# Altium project Manipulator.PrjPcb
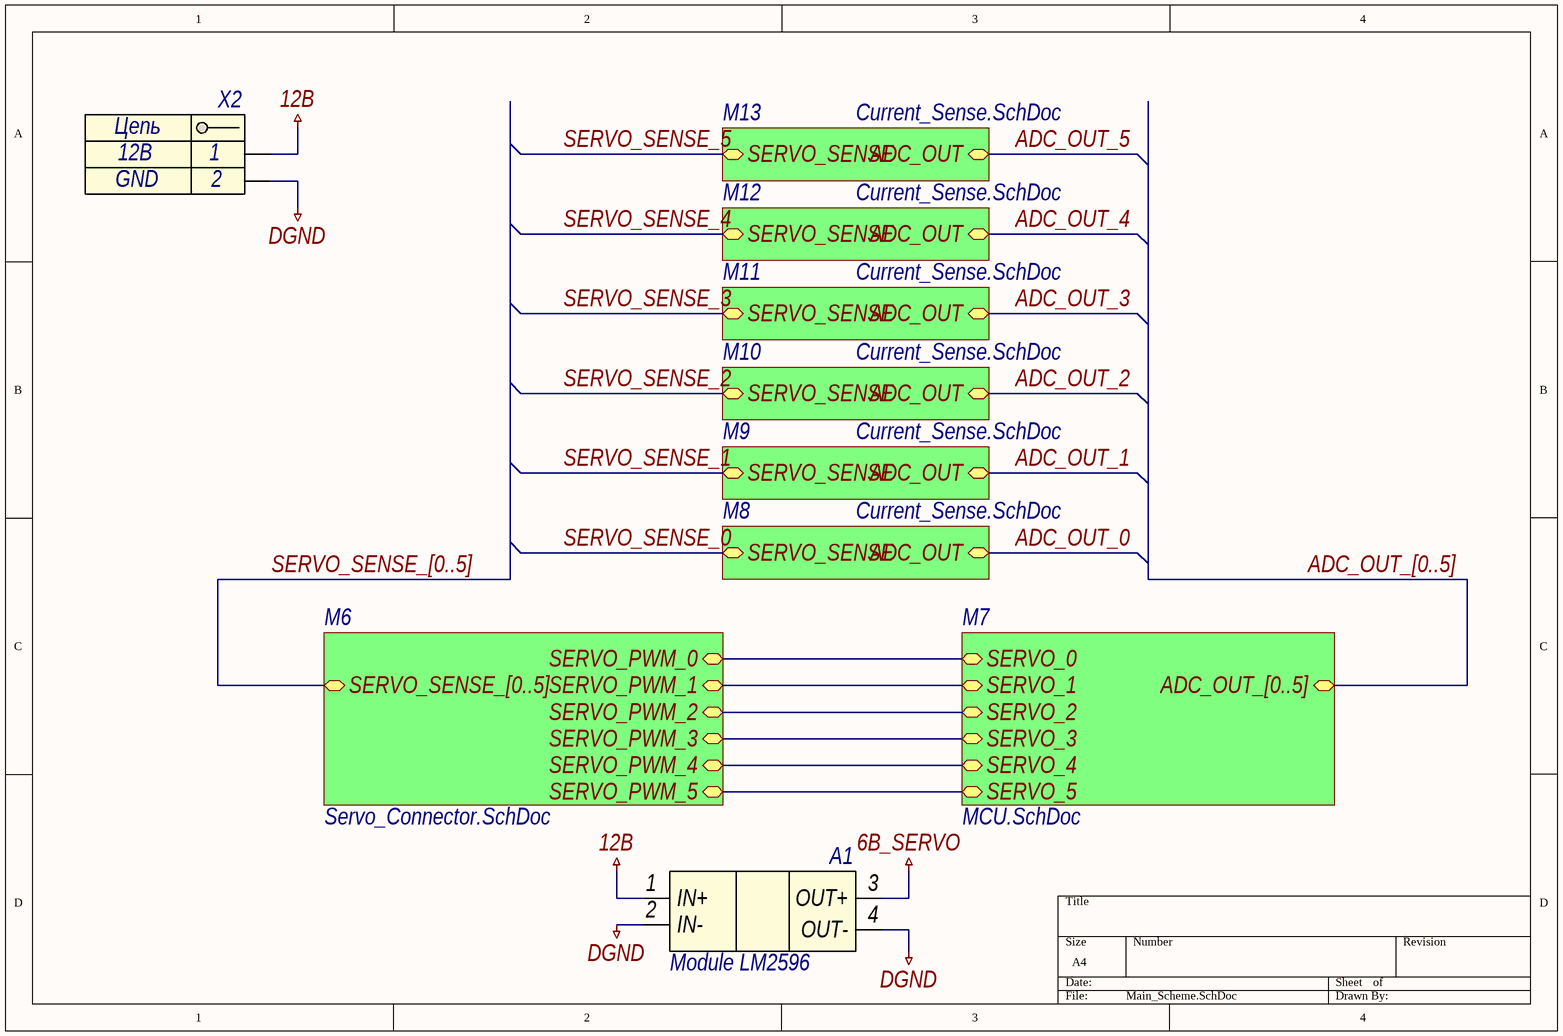
[diagram p0: Main_Scheme.SchDoc]
4 sheets, 55 parts. Net scope: hierarchical (ports join the sheet entries above them; power ports are global).
Board file: Manipulator.PcbDoc
Sheets:
  Main_Scheme.SchDoc
    M6 = Servo_Connector.SchDoc
    M7 = MCU.SchDoc
    M8 = Current_Sense.SchDoc
    M9 = Current_Sense.SchDoc
    M10 = Current_Sense.SchDoc
    M11 = Current_Sense.SchDoc
    M12 = Current_Sense.SchDoc
    M13 = Current_Sense.SchDoc

## Sheet Main_Scheme.SchDoc
size A4

### Parts
A1  Module LM2596  [module LM2596]
X2  Header_2_trm  [TERMINAL-2WAY-3.5MM]  (value not drawn)

### Sub-sheets
M6 = Servo_Connector.SchDoc: SERVO_PWM_3, SERVO_PWM_2, SERVO_PWM_4, SERVO_PWM_5, SERVO_PWM_0, SERVO_PWM_1, SERVO_SENSE_[0..5]
M7 = MCU.SchDoc: SERVO_0, SERVO_5, SERVO_4, SERVO_3, SERVO_2, SERVO_1, ADC_OUT_[0..5]
M8 = Current_Sense.SchDoc: ADC_OUT, SERVO_SENSE
M9 = Current_Sense.SchDoc: ADC_OUT, SERVO_SENSE
M10 = Current_Sense.SchDoc: ADC_OUT, SERVO_SENSE
M11 = Current_Sense.SchDoc: ADC_OUT, SERVO_SENSE
M12 = Current_Sense.SchDoc: ADC_OUT, SERVO_SENSE
M13 = Current_Sense.SchDoc: ADC_OUT, SERVO_SENSE

### Nets
6В_SERVO: A1.3(OUT+)
12В: A1.1(IN+) X2.1
DGND: A1.2(IN-) A1.4(OUT-) X2.2
NetDD1_1: sheet M6/SERVO_PWM_3, sheet M7/SERVO_3
NetDD1_2: sheet M6/SERVO_PWM_4, sheet M7/SERVO_4
NetDD1_9: sheet M6/SERVO_PWM_5, sheet M7/SERVO_5
NetDD1_30: sheet M6/SERVO_PWM_0, sheet M7/SERVO_0
NetDD1_31: sheet M6/SERVO_PWM_1, sheet M7/SERVO_1
NetDD1_32: sheet M6/SERVO_PWM_2, sheet M7/SERVO_2

### Buses and harness runs
bus ADC_OUT_[0..5] = sheet M7/ADC_OUT_[0..5]
bus SERVO_SENSE_[0..5] = sheet M6/SERVO_SENSE_[0..5]

### Notes on the sheet
- (in symbol connect34) Цепь

### Library data of the parts
A1 = module0: Low-Dropout Regulator for 5-V to 3.3-V Conversion; id: module0; Part Name: LM2596
X2 = connect34: Разъем - 2 конт. клеммник; Part Name: TERMINAL BLOCK 2 way; Contact_1: 12В; Contact_2: GND; Etch: 3.5mm; id: connect34

## Sheet Servo_Connector.SchDoc
size A4
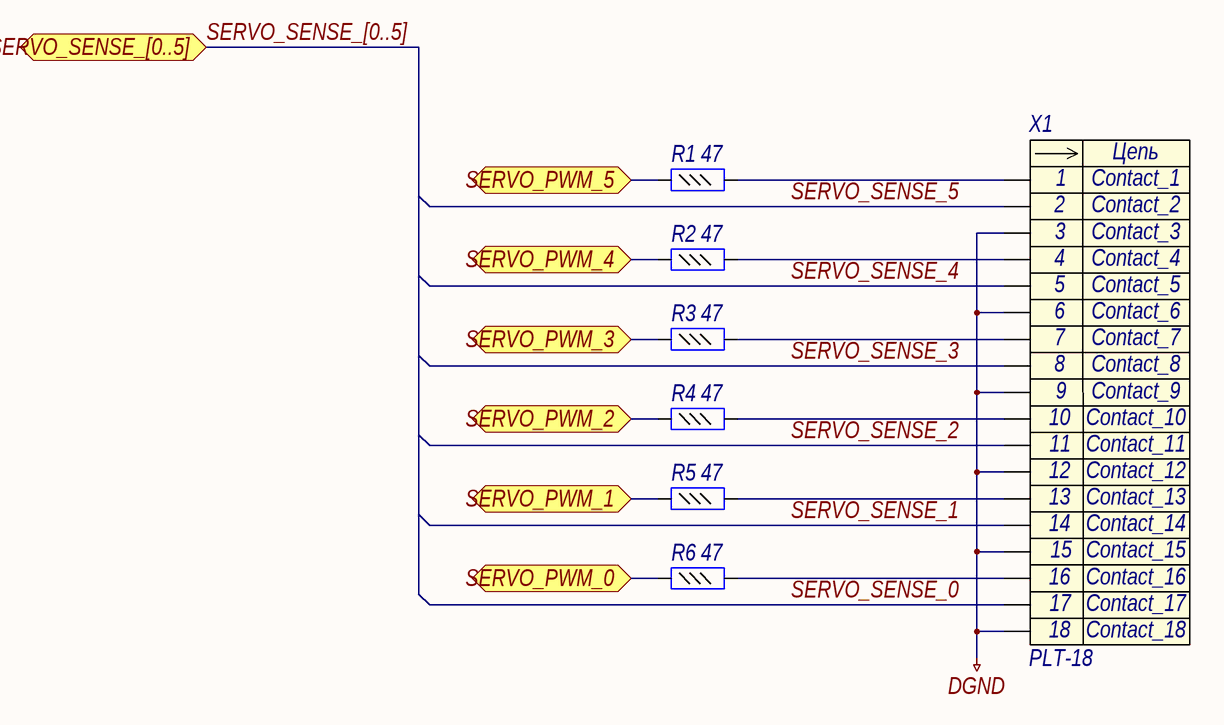
[diagram p1: Servo_Connector.SchDoc]

### Parts
R1  value 47  [R0603]  (hidden comment: Resistor_0,062Вт)
R2  value 47  [R0603]  (hidden comment: Resistor_0,062Вт)
R3  value 47  [R0603]  (hidden comment: Resistor_0,062Вт)
R4  value 47  [R0603]  (hidden comment: Resistor_0,062Вт)
R5  value 47  [R0603]  (hidden comment: Resistor_0,062Вт)
R6  value 47  [R0603]  (hidden comment: Resistor_0,062Вт)
X1  PLT-18  [PLT-18]

### Ports
SERVO_PWM_0, SERVO_PWM_1, SERVO_PWM_2, SERVO_PWM_3, SERVO_PWM_4, SERVO_PWM_5, SERVO_SENSE_[0..5]

### Nets
DGND: X1.3 X1.6 X1.9 X1.12 X1.15 X1.18
SERVO_SENSE_0: X1.17
SERVO_SENSE_1: X1.14
SERVO_SENSE_2: X1.11
SERVO_SENSE_3: X1.8
SERVO_SENSE_4: X1.5
SERVO_SENSE_5: X1.2
NetDD1_1: R3.1 ; port SERVO_PWM_3
NetDD1_2: R2.1 ; port SERVO_PWM_4
NetDD1_9: R1.1 ; port SERVO_PWM_5
NetDD1_30: R6.1 ; port SERVO_PWM_0
NetDD1_31: R5.1 ; port SERVO_PWM_1
NetDD1_32: R4.1 ; port SERVO_PWM_2
NetR1_2: R1.2 X1.1
NetR2_2: R2.2 X1.4
NetR3_2: R3.2 X1.7
NetR4_2: R4.2 X1.10
NetR5_2: R5.2 X1.13
NetR6_2: R6.2 X1.16

### Buses and harness runs
bus SERVO_SENSE_[0..5] = port SERVO_SENSE_[0..5]

### Notes on the sheet
- (in symbol connect129) Цепь

### Library data of the parts
R1-R6 = res431: Резистор; Manufacture: Yageo; Part Number: RC0603FR-0747RL; id: res431; Accuracy: 0,01; Part Name: Resistor; Power: 0,062Вт
X1 = connect129: Разъем - 18 конт. вилка; Part Number: PLT-81; Manufacture: Ningbo connfly electronic; Etch: 2.54mm; Part Name: PLT-18; Contact_1: Contact_1; Contact_2: Contact_2; Contact_3: Contact_3; Contact_4: Contact_4; Contact_5: Contact_5; Contact_6: Contact_6; id: connect129; Contact_7: Contact_7; Contact_8: Contact_8; Contact_9: Contact_9; Contact_10: Contact_10; Contact_11: Contact_11; Contact_12: Contact_12; Contact_13: Contact_13; Contact_14: Contact_14; Contact_15: Contact_15; Contact_16: Contact_16; Contact_17: Contact_17; Contact_18: Contact_18; Contact_19: Contact_19; Contact_20: Contact_20

## Sheet MCU.SchDoc
size A3
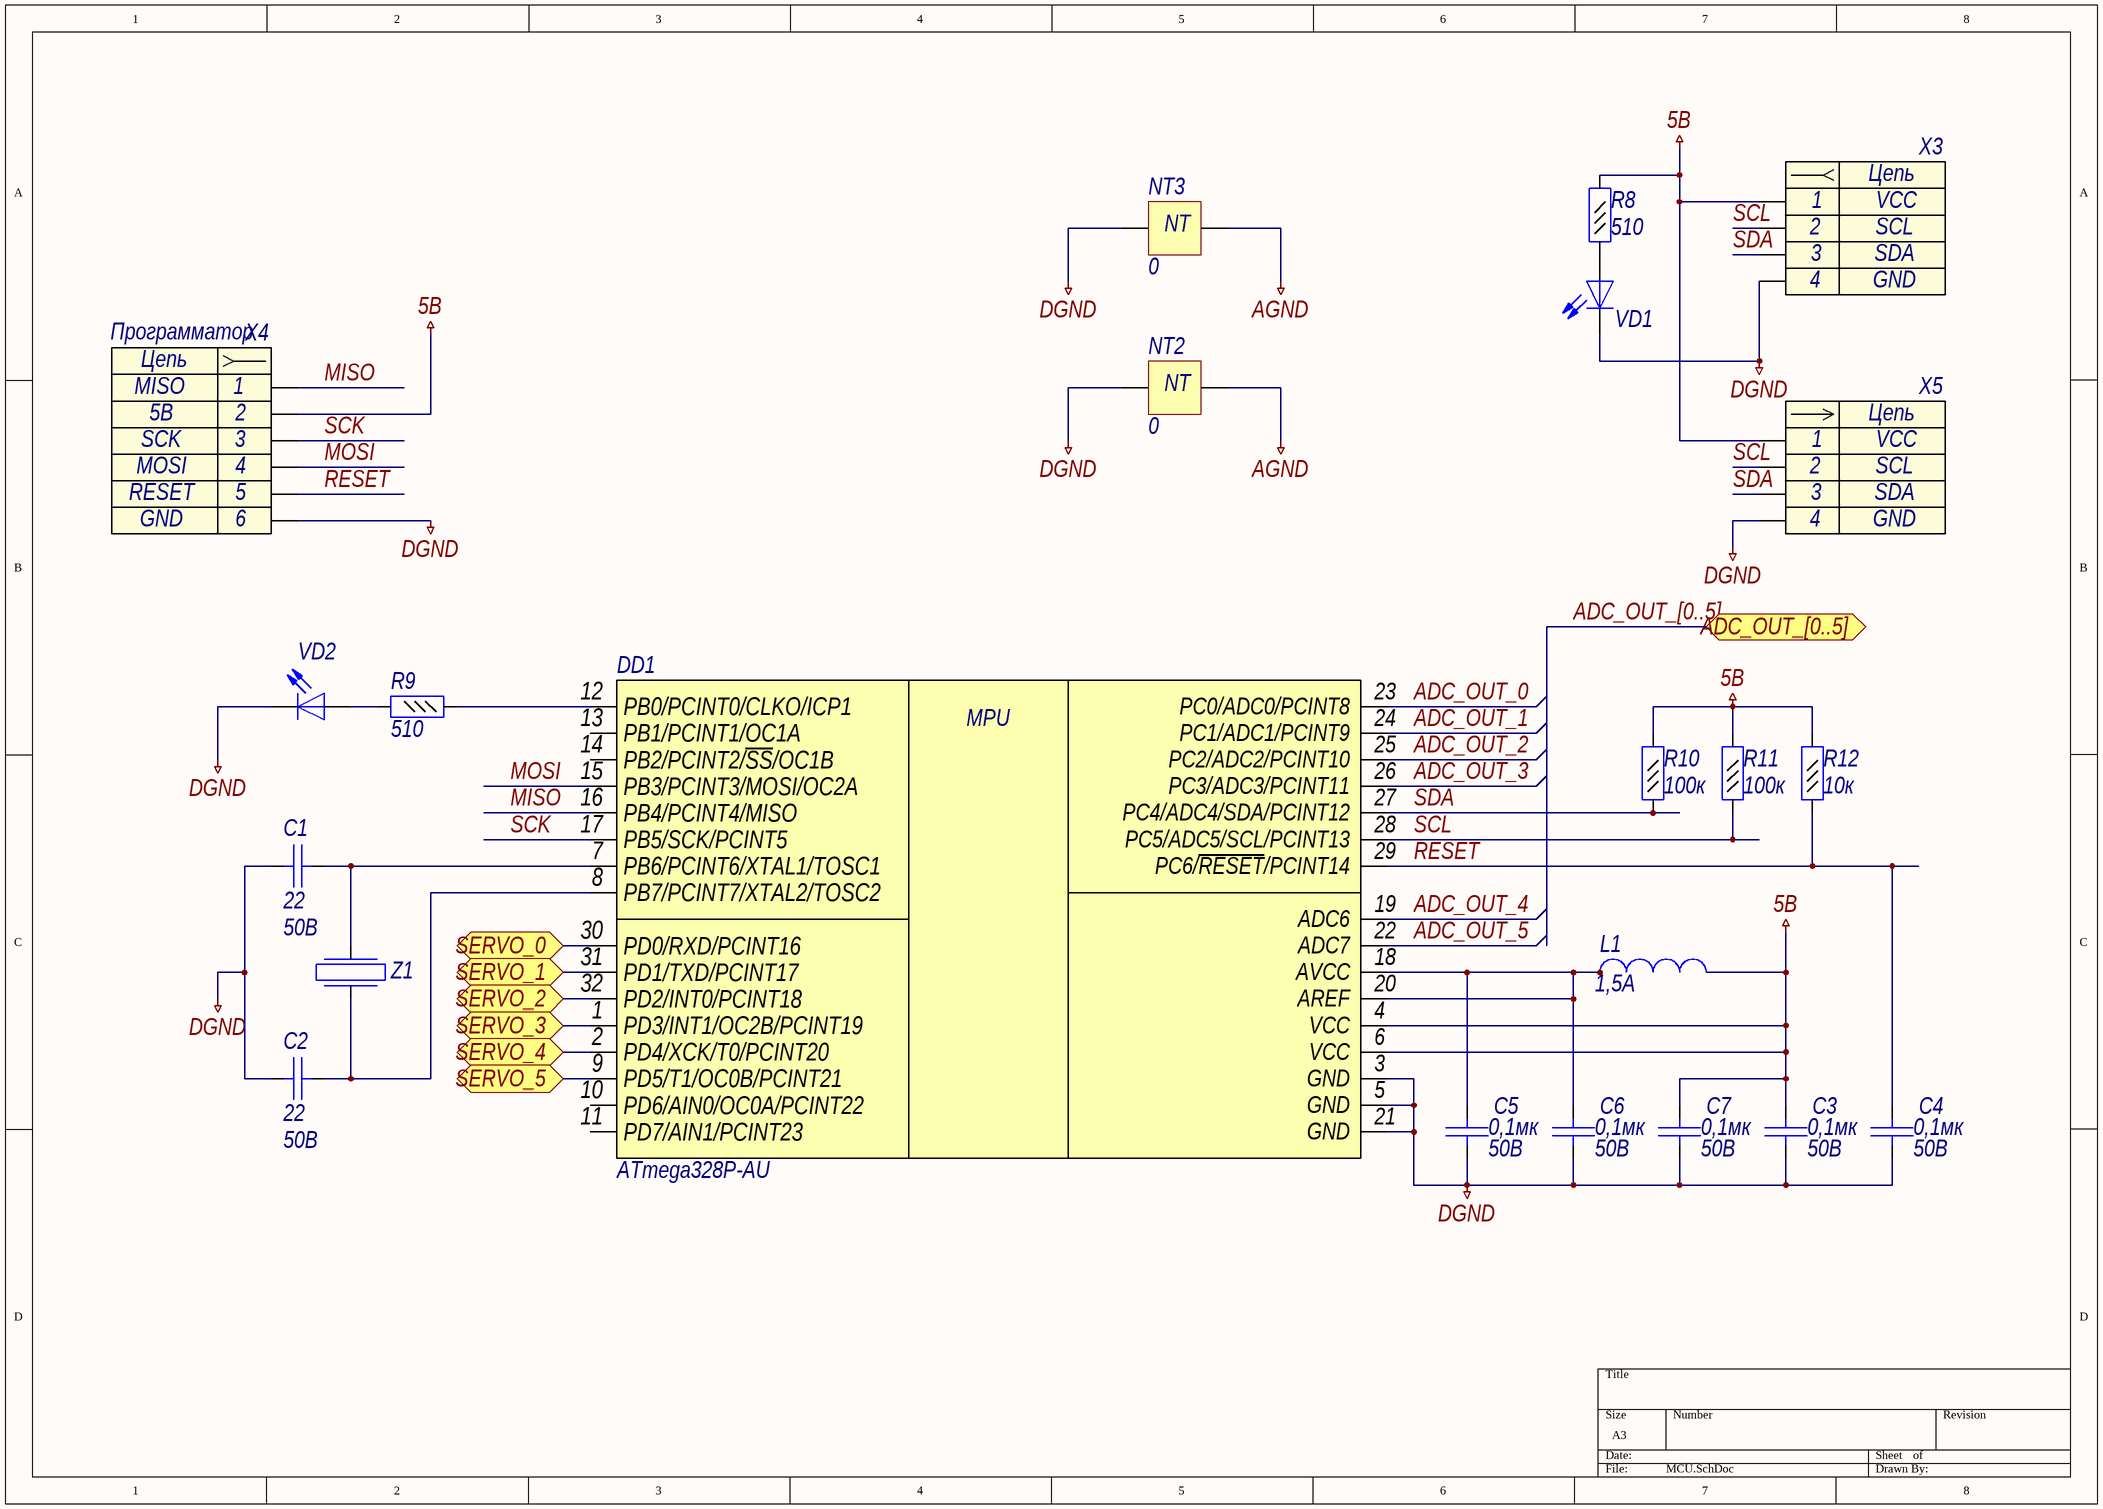
[diagram p2: MCU.SchDoc]

### Parts
C1  Voltage: 50B  [C0603]  (hidden comment: 22)
C2  Voltage: 50B  [C0603]  (hidden comment: 22)
C3  Voltage: 50B  [C0603]  (hidden comment: 0,1мк)
C4  Voltage: 50B  [C0603]  (hidden comment: 0,1мк)
C5  Voltage: 50B  [C0603]  (hidden comment: 0,1мк)
C6  Voltage: 50B  [C0603]  (hidden comment: 0,1мк)
C7  Voltage: 50B  [C0603]  (hidden comment: 0,1мк)
DD1  ATmega328P-AU  [TQFP-32]
L1  Rated Current: 1,5A  [L0603]  (hidden comment: Inductor)
NT2  value 0  [Pofigistor0603]  (hidden comment: Pofigistor)  (net tie, no BOM)
NT3  value 0  [Pofigistor0603]  (hidden comment: Pofigistor)  (net tie, no BOM)
R8  value 510  [R0603]  (hidden comment: Resistor_0,062Вт)
R9  value 510  [R0603]  (hidden comment: Resistor_0,062Вт)
R10  value 100к  [R0603]  (hidden comment: Resistor_0,062Вт)
R11  value 100к  [R0603]  (hidden comment: Resistor_0,062Вт)
R12  value 10к  [R0603]  (hidden comment: Resistor_0,062Вт)
VD1  LED  [L_0805]  (value not drawn)
VD2  LED  [L_0805]  (value not drawn)
X3  Header_4_sct  [RJ11_4P4C_V]  (value not drawn)
X4  Программатор  [PLS2-6]
X5  Header_4_plg  [PLS-4]  (value not drawn)
Z1  Crystal  [HC-49SM]  (value not drawn)

### Ports
ADC_OUT_[0..5], SERVO_0, SERVO_1, SERVO_2, SERVO_3, SERVO_4, SERVO_5

### Nets
5В: C3.2 C7.2 DD1.4(VCC) DD1.6(VCC) L1.2 R8.2 R10.2 R11.2 R12.2 X3.1 X4.2 X5.1
AGND: NT2.2 NT3.2
DGND: C1.1 C2.1 C3.1 C4.1 C5.1 C6.1 C7.1 DD1.3(GND) DD1.5(GND) DD1.21(GND) NT2.1 NT3.1 VD1.1(K) VD2.1(K) X3.4 X4.6 X5.4
ADC_OUT_0: DD1.23(PC0/ADC0/PCINT8)
ADC_OUT_1: DD1.24(PC1/ADC1/PCINT9)
ADC_OUT_2: DD1.25(PC2/ADC2/PCINT10)
ADC_OUT_3: DD1.26(PC3/ADC3/PCINT11)
ADC_OUT_4: DD1.19(ADC6)
ADC_OUT_5: DD1.22(ADC7)
MISO: DD1.16(PB4/PCINT4/MISO) X4.1
MOSI: DD1.15(PB3/PCINT3/MOSI/OC2A) X4.4
RESET: C4.2 DD1.29(PC6/~{RESET}/PCINT14) R12.1 X4.5
SCK: DD1.17(PB5/SCK/PCINT5) X4.3
SCL: DD1.28(PC5/ADC5/SCL/PCINT13) R11.1 X3.2 X5.2
SDA: DD1.27(PC4/ADC4/SDA/PCINT12) R10.1 X3.3 X5.3
NetC1_2: C1.2 DD1.7(PB6/PCINT6/XTAL1/TOSC1) Z1.2
NetC2_2: C2.2 DD1.8(PB7/PCINT7/XTAL2/TOSC2) Z1.1
NetC5_2: C5.2 C6.2 DD1.18(AVCC) DD1.20(AREF) L1.1
NetDD1_1: DD1.1(PD3/INT1/OC2B/PCINT19) ; port SERVO_3
NetDD1_2: DD1.2(PD4/XCK/T0/PCINT20) ; port SERVO_4
NetDD1_9: DD1.9(PD5/T1/OC0B/PCINT21) ; port SERVO_5
NetDD1_12: DD1.12(PB0/PCINT0/CLKO/ICP1) R9.1
NetDD1_30: DD1.30(PD0/RXD/PCINT16) ; port SERVO_0
NetDD1_31: DD1.31(PD1/TXD/PCINT17) ; port SERVO_1
NetDD1_32: DD1.32(PD2/INT0/PCINT18) ; port SERVO_2
NetR8_1: R8.1 VD1.2(A)
NetR9_2: R9.2 VD2.2(A)

Not connected (* = marked no-connect by the designer): DD1 10(PD6/AIN0/OC0A/PCINT22) 11(PD7/AIN1/PCINT23) 13(PB1/PCINT1/OC1A) 14(PB2/PCINT2/~{SS}/OC1B)

### Buses and harness runs
bus ADC_OUT_[0..5] = port ADC_OUT_[0..5]

### Notes on the sheet
- (in symbol connect0) Цепь
- (in symbol connect14) Цепь
- (in symbol connect73) Цепь
- (in symbol microcont1) MPU
- (in symbol res970) NT

### Library data of the parts
C1 C2 = cap77: Конденсатор; Part Name: Ceramic; Manufacture: Yageo; Part Number: CC0603JRNPO9BN220; id: cap77; TKE: NP0; Value: 22
C3-C7 = cap131: Конденсатор; Part Name: Ceramic; Manufacture: Murata; Part Number: GRM188R71H104KA93D; id: cap131; TKE: X7R; Value: 0,1мк
DD1 = microcont1: Микроконтроллер 8-Бит, picoPower, AVR, 20МГц, 32КБ Flash; Part Name: Microcontroller; Frequency: 20MHz; ADC: 8x10b; Interface: i2c, spi, uart; Flash: 32kb; Pin in: 23; Power Supply: 1.8-5.5 V; id: microcont1; Part Number: ATmega328P-AU
L1 = ind0: EMI Suppression Filter; Part Name: EMI Suppression Filters; Part Number: BLM18PG181SN1D; id: ind0; Resistance: 0,09Ohm
NT2 NT3 = res970: Part Name: NET TIE; id: res970
R8 R9 = res456: Резистор; Manufacture: Yageo; Part Number: RC0603FR-07510RL; id: res456; Accuracy: 0,01; Part Name: Resistor; Power: 0,062Вт
R10 R11 = res511: Резистор; Manufacture: Yageo; Part Number: RC0603FR-07100KL; id: res511; Accuracy: 0,01; Part Name: Resistor; Power: 0,062Вт
R12 = res487: Резистор; Manufacture: Yageo; Part Number: RC0603FR-0710KL; id: res487; Accuracy: 0,01; Part Name: Resistor; Power: 0,062Вт
VD1 VD2 = diode5: Светодиод; Part Number: KP-2012EC; id: diode5; Part Name: LED
X3 = connect73: Разъем - 4 конт. розетка; Part Name: Jack 4p4c (RJ11, RJ14) Vertical; Contact_1: VCC; Contact_2: SCL; Contact_3: SDA; Contact_4: GND; id: connect73
X4 = connect0: Разъем - 6 конт. розетка; Part Name: MKII; Contact_1: MISO; Contact_2: 5B; Contact_3: SCK; Contact_4: MOSI; Contact_5: RESET; Contact_6: GND; id: connect0
X5 = connect14: Разъем - 4 конт. вилка; Part Number: DS1021-1*4SF112-B; Manufacture: Ningbo connfly electronic; Contact_1: VCC; Contact_2: SCL; Contact_3: SDA; Contact_4: GND; Etch: 2,54mm; Part Name: PLS-4; id: connect14
Z1 = crystal16: Кварцевый резонатор; Manufacture: Китай; Part Number: 16.000MHzHC-49SM; Frequence: 16MHz; id: crystal16

## Sheet Current_Sense.SchDoc
size A4
Used 6 times, as channels M8, M9, M10, M11, M12, M13. Parts and nets are listed once, with the designators drawn on the sheet.
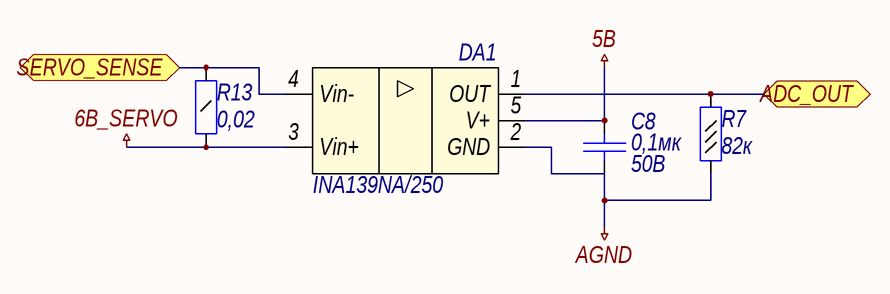
[diagram p3: Current_Sense.SchDoc]

### Parts
C8  Voltage: 50B  [C0603]  (hidden comment: 0,1мк)
DA1  INA139NA/250  [SOT23-5]
R7  value 82к  [R0603]  (hidden comment: Resistor_0,062Вт)
R13  value 0,02  [R1206]  (hidden comment: Resistor_0,25Вт)

### Ports
ADC_OUT, SERVO_SENSE

### Nets
5В: C8.2 DA1.5(V+)
6В_SERVO: DA1.3(Vin+) R13.1
AGND: C8.1 DA1.2(GND) R7.1
ADC_OUT: DA1.1(OUT) R7.2 ; port ADC_OUT
SERVO_SENSE: DA1.4(Vin-) R13.2 ; port SERVO_SENSE

### Channels
M8: designators C8=C8_M8 DA1=DA1 R7=R7_M8 R13=R13_M8; ports ADC_OUT=ADC_OUT_0 SERVO_SENSE=SERVO_SENSE_0
M9: designators C8=C8_M9 DA1=DA2 R7=R7_M9 R13=R13_M9; ports ADC_OUT=ADC_OUT_1 SERVO_SENSE=SERVO_SENSE_1
M10: designators C8=C8_M10 DA1=DA3 R7=R7_M10 R13=R13_M10; ports ADC_OUT=ADC_OUT_2 SERVO_SENSE=SERVO_SENSE_2
M11: designators C8=C8_M11 DA1=DA4 R7=R7_M11 R13=R13_M11; ports ADC_OUT=ADC_OUT_3 SERVO_SENSE=SERVO_SENSE_3
M12: designators C8=C8_M12 DA1=DA5 R7=R7_M12 R13=R13_M12; ports ADC_OUT=ADC_OUT_4 SERVO_SENSE=SERVO_SENSE_4
M13: designators C8=C8_M13 DA1=DA6 R7=R7_M13 R13=R13_M13; ports ADC_OUT=ADC_OUT_5 SERVO_SENSE=SERVO_SENSE_5

### Library data of the parts
C8 = cap131: as C3 on sheet MCU; Value: 0,1мк
DA1 = amp3: Измерительный датчик тока; Part Name: Measurement Current Shunt Monitor; Manufacture: Texas Instruments; id: amp3; Rail-to-rail: independent; Supply Voltage: 2,7-5-40B; Supply Current max: 60uA; Bandwidth: rout=20  220kHz; Input Bias Current: 10uA; CMRR: 115dB; Offset voltage: 0,2mB; Channels: 1; Part Number: INA139NA/250
R7 = res509: Резистор; Manufacture: Yageo; Part Number: RC0603FR-0782KL; id: res509; Accuracy: 0,01; Part Name: Resistor; Power: 0,062Вт
R13 = res1246: Резистор; Part Name: Shunt; Manufacture: Yageo; Part Number: RL1206FR-070R02L; Accuracy: 0,01; Power: 0,25Вт; id: res1246

## Nets that join several sheets
5В: MCU (12 pins), M8 (C8_M8.2 DA1.5), M9 (C8_M9.2 DA2.5), M10 (C8_M10.2 DA3.5), M11 (C8_M11.2 DA4.5), M12 (C8_M12.2 DA5.5), M13 (C8_M13.2 DA6.5)
6В_SERVO: Main_Scheme (A1.3), M8 (DA1.3 R13_M8.1), M9 (DA2.3 R13_M9.1), M10 (DA3.3 R13_M10.1), M11 (DA4.3 R13_M11.1), M12 (DA5.3 R13_M12.1), M13 (DA6.3 R13_M13.1)
AGND: MCU (NT2.2 NT3.2), M8 (C8_M8.1 DA1.2 R7_M8.1), M9 (C8_M9.1 DA2.2 R7_M9.1), M10 (C8_M10.1 DA3.2 R7_M10.1), M11 (C8_M11.1 DA4.2 R7_M11.1), M12 (C8_M12.1 DA5.2 R7_M12.1), M13 (C8_M13.1 DA6.2 R7_M13.1)
DGND: Main_Scheme (A1.2 A1.4 X2.2), Servo_Connector (6 pins), MCU (17 pins)
ADC_OUT_0: MCU (DD1.23), M8 (DA1.1 R7_M8.2)
ADC_OUT_1: MCU (DD1.24), M9 (DA2.1 R7_M9.2)
ADC_OUT_2: MCU (DD1.25), M10 (DA3.1 R7_M10.2)
ADC_OUT_3: MCU (DD1.26), M11 (DA4.1 R7_M11.2)
ADC_OUT_4: MCU (DD1.19), M12 (DA5.1 R7_M12.2)
ADC_OUT_5: MCU (DD1.22), M13 (DA6.1 R7_M13.2)
NetDD1_1: Servo_Connector (R3.1), MCU (DD1.1)
NetDD1_2: Servo_Connector (R2.1), MCU (DD1.2)
NetDD1_9: Servo_Connector (R1.1), MCU (DD1.9)
NetDD1_30: Servo_Connector (R6.1), MCU (DD1.30)
NetDD1_31: Servo_Connector (R5.1), MCU (DD1.31)
NetDD1_32: Servo_Connector (R4.1), MCU (DD1.32)
SERVO_SENSE_0: Servo_Connector (X1.17), M8 (DA1.4 R13_M8.2)
SERVO_SENSE_1: Servo_Connector (X1.14), M9 (DA2.4 R13_M9.2)
SERVO_SENSE_2: Servo_Connector (X1.11), M10 (DA3.4 R13_M10.2)
SERVO_SENSE_3: Servo_Connector (X1.8), M11 (DA4.4 R13_M11.2)
SERVO_SENSE_4: Servo_Connector (X1.5), M12 (DA5.4 R13_M12.2)
SERVO_SENSE_5: Servo_Connector (X1.2), M13 (DA6.4 R13_M13.2)